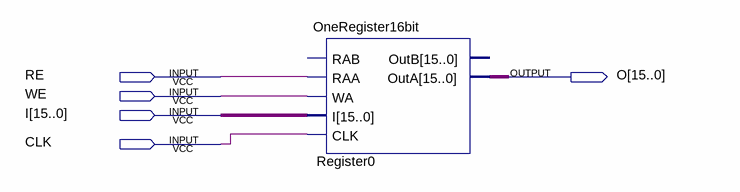
[diagram p0: schematic sheet]
// Quartus schematic Reg16Sharing.bdf as structural Verilog: 1 symbols, 5 pins
module Reg16Sharing (
  input  RE,
  input  WE,
  input  [15:0] I,
  input  CLK,
  output [15:0] O
);

  OneRegister16bit Register0 (.RAA(RE), .WA(WE), .I(I), .CLK(CLK), .OutA(O));  // open: RAB, OutB
endmodule
